# Altium schematic sheet 16KNOBS.SchDoc
size A4; SheetNumber: 3; SheetTotal: 5
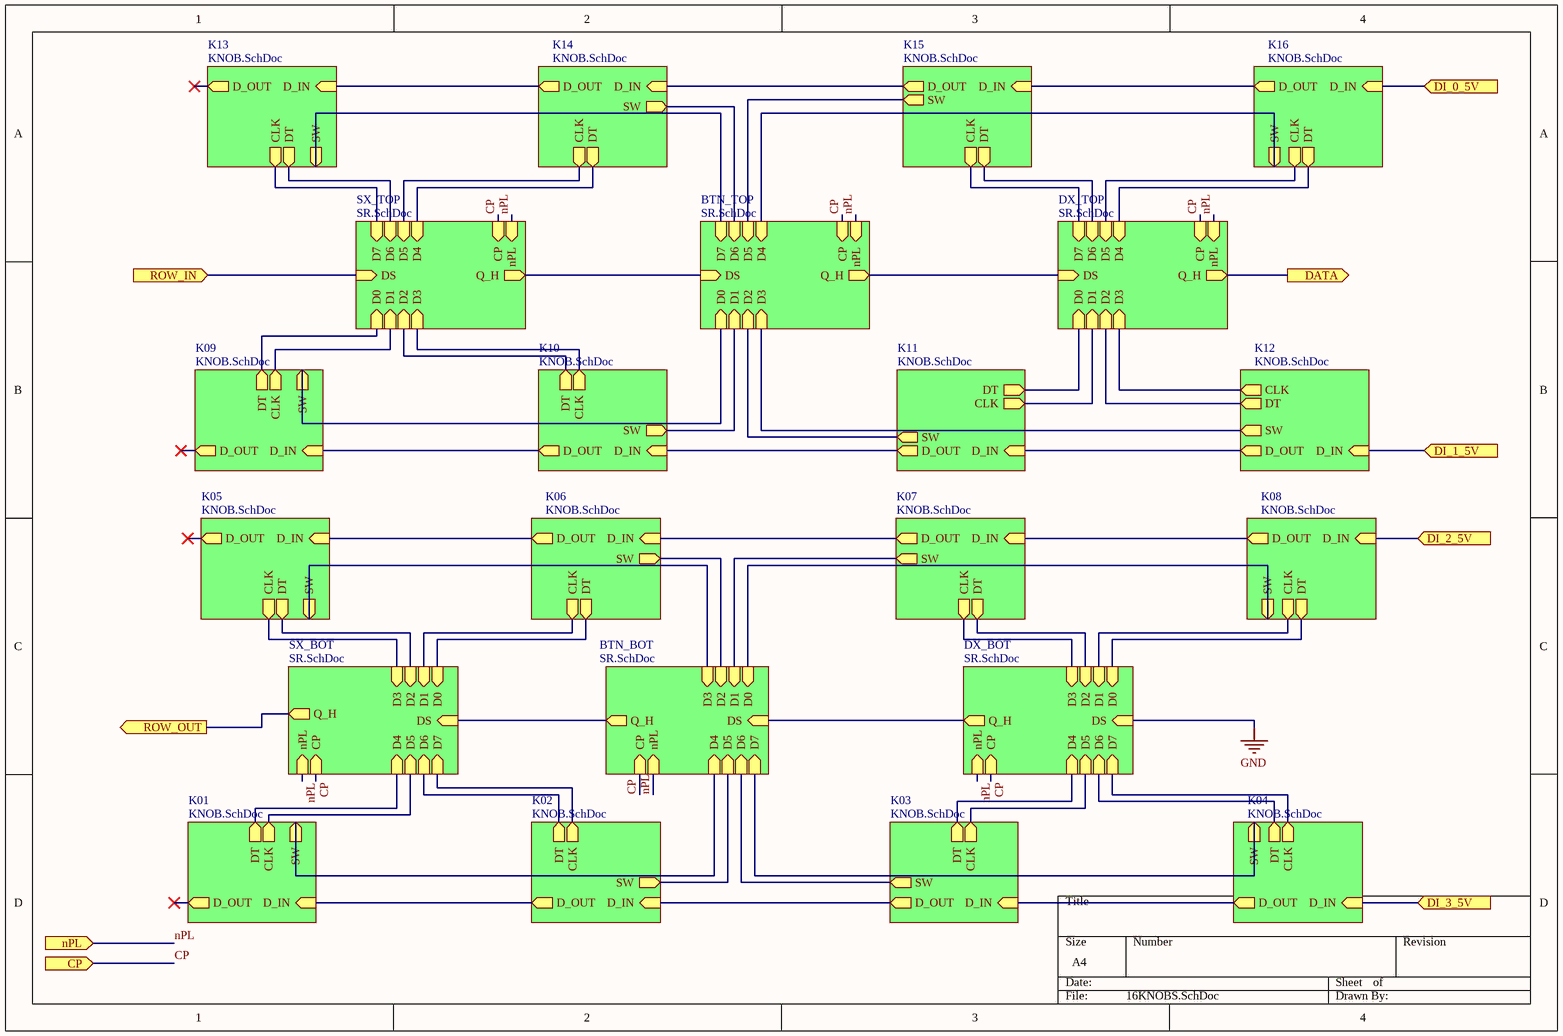
[diagram p0: 16KNOBS.SchDoc]

## Sub-sheets
BTN_BOT = SR.SchDoc: nPL (in), CP (in), DS (in), Q_H (out), D4 (in), D5 (in), D6 (in), D7 (in), D0 (in), D1 (in), D2 (in), D3 (in)
BTN_TOP = SR.SchDoc: nPL (in), CP (in), DS (in), Q_H (out), D4 (in), D5 (in), D6 (in), D7 (in), D0 (in), D1 (in), D2 (in), D3 (in)
DX_BOT = SR.SchDoc: nPL (in), CP (in), DS (in), Q_H (out), D4 (in), D5 (in), D6 (in), D7 (in), D0 (in), D1 (in), D2 (in), D3 (in)
DX_TOP = SR.SchDoc: nPL (in), CP (in), DS (in), Q_H (out), D4 (in), D5 (in), D6 (in), D7 (in), D0 (in), D1 (in), D2 (in), D3 (in)
K01 = KNOB.SchDoc: SW (out), DT (out), CLK (out), D_IN (in), D_OUT (out)
K02 = KNOB.SchDoc: SW (out), DT (out), CLK (out), D_IN (in), D_OUT (out)
K03 = KNOB.SchDoc: SW (out), DT (out), CLK (out), D_IN (in), D_OUT (out)
K04 = KNOB.SchDoc: SW (out), DT (out), CLK (out), D_IN (in), D_OUT (out)
K05 = KNOB.SchDoc: SW (out), DT (out), CLK (out), D_IN (in), D_OUT (out)
K06 = KNOB.SchDoc: SW (out), DT (out), CLK (out), D_IN (in), D_OUT (out)
K07 = KNOB.SchDoc: SW (out), DT (out), CLK (out), D_IN (in), D_OUT (out)
K08 = KNOB.SchDoc: SW (out), DT (out), CLK (out), D_IN (in), D_OUT (out)
K09 = KNOB.SchDoc: SW (out), DT (out), CLK (out), D_IN (in), D_OUT (out)
K10 = KNOB.SchDoc: SW (out), DT (out), CLK (out), D_IN (in), D_OUT (out)
K11 = KNOB.SchDoc: SW (out), DT (out), CLK (out), D_IN (in), D_OUT (out)
K12 = KNOB.SchDoc: SW (out), DT (out), CLK (out), D_IN (in), D_OUT (out)
K13 = KNOB.SchDoc: SW (out), DT (out), CLK (out), D_IN (in), D_OUT (out)
K14 = KNOB.SchDoc: SW (out), DT (out), CLK (out), D_IN (in), D_OUT (out)
K15 = KNOB.SchDoc: SW (out), DT (out), CLK (out), D_IN (in), D_OUT (out)
K16 = KNOB.SchDoc: SW (out), DT (out), CLK (out), D_IN (in), D_OUT (out)
SX_BOT = SR.SchDoc: nPL (in), CP (in), DS (in), Q_H (out), D4 (in), D5 (in), D6 (in), D7 (in), D0 (in), D1 (in), D2 (in), D3 (in)
SX_TOP = SR.SchDoc: nPL (in), CP (in), DS (in), Q_H (out), D4 (in), D5 (in), D6 (in), D7 (in), D0 (in), D1 (in), D2 (in), D3 (in)

## Ports
CP (in), DATA (out), DI_0_5V (in), DI_1_5V (in), DI_2_5V (in), DI_3_5V (in), nPL (in), ROW_IN (in), ROW_OUT (out)

## Nets
GND: sheet DX_BOT/DS
CP: port CP, sheet BTN_TOP/CP, sheet SX_TOP/CP, sheet DX_TOP/CP, sheet BTN_BOT/CP, sheet SX_BOT/CP, sheet DX_BOT/CP
DATA: port DATA, sheet DX_TOP/Q_H
DI_0_5V: port DI_0_5V, sheet K16/D_IN
DI_1_5V: port DI_1_5V, sheet K12/D_IN
DI_2_5V: port DI_2_5V, sheet K08/D_IN
DI_3_5V: port DI_3_5V, sheet K04/D_IN
nPL: port nPL, sheet BTN_TOP/nPL, sheet SX_TOP/nPL, sheet DX_TOP/nPL, sheet BTN_BOT/nPL, sheet SX_BOT/nPL, sheet DX_BOT/nPL
ROW_IN: port ROW_IN, sheet SX_TOP/DS
ROW_OUT: port ROW_OUT, sheet SX_BOT/Q_H
(unnamed): sheet K13/SW, sheet BTN_TOP/D7
(unnamed): sheet K13/DT, sheet SX_TOP/D6
(unnamed): sheet K13/CLK, sheet SX_TOP/D7
(unnamed): sheet K13/D_IN, sheet K14/D_OUT
(unnamed): sheet K14/SW, sheet BTN_TOP/D6
(unnamed): sheet K14/DT, sheet SX_TOP/D4
(unnamed): sheet K14/CLK, sheet SX_TOP/D5
(unnamed): sheet K14/D_IN, sheet K15/D_OUT
(unnamed): sheet K09/SW, sheet BTN_TOP/D0
(unnamed): sheet K09/DT, sheet SX_TOP/D0
(unnamed): sheet K09/CLK, sheet SX_TOP/D1
(unnamed): sheet K09/D_IN, sheet K10/D_OUT
(unnamed): sheet K10/SW, sheet BTN_TOP/D1
(unnamed): sheet K10/DT, sheet SX_TOP/D2
(unnamed): sheet K10/CLK, sheet SX_TOP/D3
(unnamed): sheet K10/D_IN, sheet K11/D_OUT
(unnamed): sheet K15/SW, sheet BTN_TOP/D5
(unnamed): sheet K15/DT, sheet DX_TOP/D6
(unnamed): sheet K15/CLK, sheet DX_TOP/D7
(unnamed): sheet K15/D_IN, sheet K16/D_OUT
(unnamed): sheet K16/SW, sheet BTN_TOP/D4
(unnamed): sheet K16/DT, sheet DX_TOP/D4
(unnamed): sheet K16/CLK, sheet DX_TOP/D5
(unnamed): sheet K11/SW, sheet BTN_TOP/D2
(unnamed): sheet K11/DT, sheet DX_TOP/D0
(unnamed): sheet K11/CLK, sheet DX_TOP/D1
(unnamed): sheet K11/D_IN, sheet K12/D_OUT
(unnamed): sheet K12/SW, sheet BTN_TOP/D3
(unnamed): sheet K12/DT, sheet DX_TOP/D2
(unnamed): sheet K12/CLK, sheet DX_TOP/D3
(unnamed): sheet BTN_TOP/DS, sheet SX_TOP/Q_H
(unnamed): sheet BTN_TOP/Q_H, sheet DX_TOP/DS
(unnamed): sheet K05/SW, sheet BTN_BOT/D3
(unnamed): sheet K05/DT, sheet SX_BOT/D2
(unnamed): sheet K05/CLK, sheet SX_BOT/D3
(unnamed): sheet K05/D_IN, sheet K06/D_OUT
(unnamed): sheet K06/SW, sheet BTN_BOT/D2
(unnamed): sheet K06/DT, sheet SX_BOT/D0
(unnamed): sheet K06/CLK, sheet SX_BOT/D1
(unnamed): sheet K06/D_IN, sheet K07/D_OUT
(unnamed): sheet K01/SW, sheet BTN_BOT/D4
(unnamed): sheet K01/DT, sheet SX_BOT/D4
(unnamed): sheet K01/CLK, sheet SX_BOT/D5
(unnamed): sheet K01/D_IN, sheet K02/D_OUT
(unnamed): sheet K02/SW, sheet BTN_BOT/D5
(unnamed): sheet K02/DT, sheet SX_BOT/D6
(unnamed): sheet K02/CLK, sheet SX_BOT/D7
(unnamed): sheet K02/D_IN, sheet K03/D_OUT
(unnamed): sheet K07/SW, sheet BTN_BOT/D1
(unnamed): sheet K07/DT, sheet DX_BOT/D2
(unnamed): sheet K07/CLK, sheet DX_BOT/D3
(unnamed): sheet K07/D_IN, sheet K08/D_OUT
(unnamed): sheet K08/SW, sheet BTN_BOT/D0
(unnamed): sheet K08/DT, sheet DX_BOT/D0
(unnamed): sheet K08/CLK, sheet DX_BOT/D1
(unnamed): sheet K03/SW, sheet BTN_BOT/D6
(unnamed): sheet K03/DT, sheet DX_BOT/D4
(unnamed): sheet K03/CLK, sheet DX_BOT/D5
(unnamed): sheet K03/D_IN, sheet K04/D_OUT
(unnamed): sheet K04/SW, sheet BTN_BOT/D7
(unnamed): sheet K04/DT, sheet DX_BOT/D6
(unnamed): sheet K04/CLK, sheet DX_BOT/D7
(unnamed): sheet BTN_BOT/DS, sheet DX_BOT/Q_H
(unnamed): sheet BTN_BOT/Q_H, sheet SX_BOT/DS